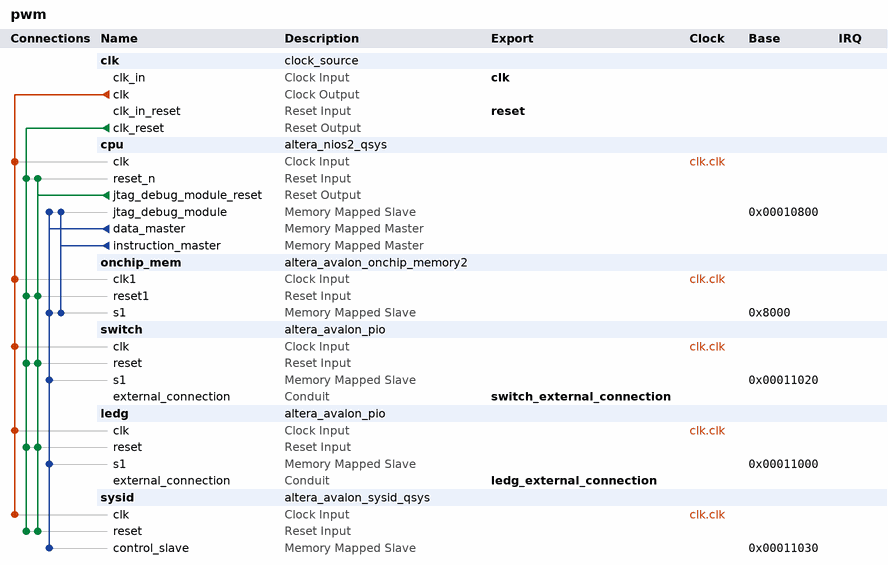
[diagram p0: system contents]
# Platform Designer (Qsys) system pwm, Cyclone II EP2C20F484C7
# Parameters at their usual value, and those the tool derives, are not listed.
package require -exact qsys 13.0
create_system pwm
set_project_property DEVICE_FAMILY {Cyclone II}
set_project_property DEVICE EP2C20F484C7

add_instance clk clock_source 13.0
set_instance_parameter_value clk clockFrequency 50000000

add_instance cpu altera_nios2_qsys 13.0
set_instance_parameter_value cpu resetSlave onchip_mem.s1
set_instance_parameter_value cpu mmu_TLBMissExcSlave None
set_instance_parameter_value cpu exceptionSlave onchip_mem.s1
set_instance_parameter_value cpu breakSlave cpu.jtag_debug_module
set_instance_parameter_value cpu impl Tiny
set_instance_parameter_value cpu icache_size 4096

add_instance onchip_mem altera_avalon_onchip_memory2 13.0.1.99.2
set_instance_parameter_value onchip_mem dataWidth 32
set_instance_parameter_value onchip_mem dualPort false
set_instance_parameter_value onchip_mem initMemContent true
set_instance_parameter_value onchip_mem initializationFileName onchip_mem.hex
set_instance_parameter_value onchip_mem memorySize 20000

add_instance switch altera_avalon_pio 13.0.1.99.2
set_instance_parameter_value switch direction Input
set_instance_parameter_value switch width 10

add_instance ledg altera_avalon_pio 13.0.1.99.2
set_instance_parameter_value ledg direction Output
set_instance_parameter_value ledg width 8

add_instance sysid altera_avalon_sysid_qsys 13.0
set_instance_parameter_value sysid id 0

# connections
add_connection clk.clk cpu.clk clock
add_connection clk.clk ledg.clk clock
add_connection clk.clk onchip_mem.clk1 clock
add_connection clk.clk switch.clk clock
add_connection clk.clk sysid.clk clock
add_connection clk.clk_reset cpu.reset_n reset
add_connection clk.clk_reset ledg.reset reset
add_connection clk.clk_reset onchip_mem.reset1 reset
add_connection clk.clk_reset switch.reset reset
add_connection clk.clk_reset sysid.reset reset
add_connection cpu.jtag_debug_module_reset cpu.reset_n reset
add_connection cpu.jtag_debug_module_reset ledg.reset reset
add_connection cpu.jtag_debug_module_reset onchip_mem.reset1 reset
add_connection cpu.jtag_debug_module_reset switch.reset reset
add_connection cpu.jtag_debug_module_reset sysid.reset reset
add_connection cpu.data_master cpu.jtag_debug_module avalon
set_connection_parameter_value cpu.data_master/cpu.jtag_debug_module baseAddress 0x00010800
add_connection cpu.data_master ledg.s1 avalon
set_connection_parameter_value cpu.data_master/ledg.s1 baseAddress 0x00011000
add_connection cpu.data_master onchip_mem.s1 avalon
set_connection_parameter_value cpu.data_master/onchip_mem.s1 baseAddress 0x8000
add_connection cpu.data_master switch.s1 avalon
set_connection_parameter_value cpu.data_master/switch.s1 baseAddress 0x00011020
add_connection cpu.data_master sysid.control_slave avalon
set_connection_parameter_value cpu.data_master/sysid.control_slave baseAddress 0x00011030
add_connection cpu.instruction_master cpu.jtag_debug_module avalon
set_connection_parameter_value cpu.instruction_master/cpu.jtag_debug_module baseAddress 0x00010800
add_connection cpu.instruction_master onchip_mem.s1 avalon
set_connection_parameter_value cpu.instruction_master/onchip_mem.s1 baseAddress 0x8000

# exported interfaces
add_interface clk clock sink
set_interface_property clk EXPORT_OF clk.clk_in
add_interface switch_external_connection conduit end
set_interface_property switch_external_connection EXPORT_OF switch.external_connection
add_interface ledg_external_connection conduit end
set_interface_property ledg_external_connection EXPORT_OF ledg.external_connection
add_interface reset reset sink
set_interface_property reset EXPORT_OF clk.clk_in_reset

set_interconnect_requirement {$system} qsys_mm.clockCrossingAdapter HANDSHAKE
set_interconnect_requirement {$system} qsys_mm.maxAdditionalLatency 1

save_system pwm.qsys
